# Altium schematic sheet OPA2350.SchDoc
size A4
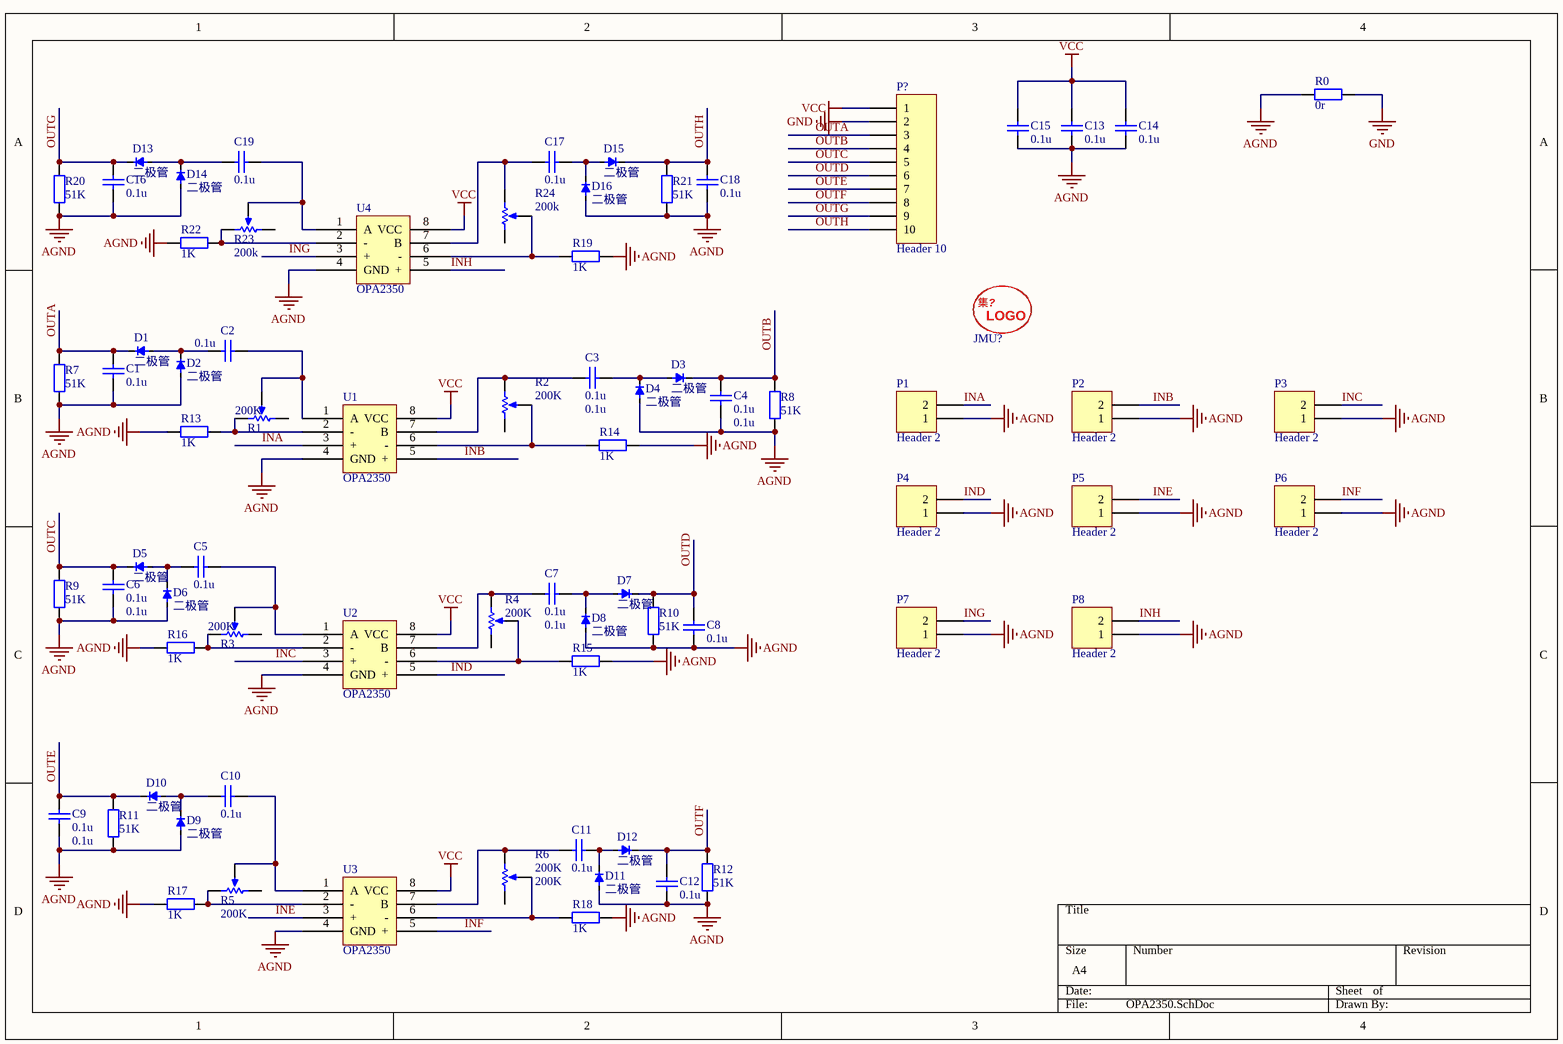
[diagram p0: OPA2350.SchDoc]

## Parts
C1  0.1u  [0805]
C2  0.1u  [0805]
C3  0.1u  [0805]
C4  0.1u  [0805]
C5  0.1u  [0805]
C6  0.1u  [0805]
C7  0.1u  [0805]
C8  0.1u  [0805]
C9  0.1u  [0805]
C10  0.1u  [0805]
C11  0.1u  [0805]
C12  0.1u  [0805]
C13  0.1u  [0805]
C14  0.1u  [0805]
C15  0.1u  [0805]
C16  0.1u  [0805]
C17  0.1u  [0805]
C18  0.1u  [0805]
C19  0.1u  [0805]
D1  二极管  [二极管]
D2  二极管  [二极管]
D3  二极管  [二极管]
D4  二极管  [二极管]
D5  二极管  [二极管]
D6  二极管  [二极管]
D7  二极管  [二极管]
D8  二极管  [二极管]
D9  二极管  [二极管]
D10  二极管  [二极管]
D11  二极管  [二极管]
D12  二极管  [二极管]
D13  二极管  [二极管]
D14  二极管  [二极管]
D15  二极管  [二极管]
D16  二极管  [二极管]
JMU?  LOGO(JMU)  [JMU_logo（1）]  (value not drawn)
P1  Header 2  [HDR1X2]
P2  Header 2  [HDR1X2]
P3  Header 2  [HDR1X2]
P4  Header 2  [HDR1X2]
P5  Header 2  [HDR1X2]
P6  Header 2  [HDR1X2]
P7  Header 2  [HDR1X2]
P8  Header 2  [HDR1X2]
P?  Header 10  [HDR1X10]
R0  0r  [0805]
R1  200K  [VR5]
R2  200K  [VR5]
R3  200K  [VR5]
R4  200K  [VR5]
R5  200K  [VR5]
R6  200K  [VR5]
R7  51K  [0805]
R8  51K  [0805]
R9  51K  [0805]
R10  51K  [0805]
R11  51K  [0805]
R12  51K  [0805]
R13  1K  [0805]
R14  1K  [0805]
R15  1K  [0805]
R16  1K  [0805]
R17  1K  [0805]
R18  1K  [0805]
R19  1K  [0805]
R20  51K  [0805]
R21  51K  [0805]
R22  1K  [0805]
R23  200k  [VR5]
R24  200k  [VR5]
U1  OPA2350  [SOIC-8]
U2  OPA2350  [SOIC-8]
U3  OPA2350  [SOIC-8]
U4  OPA2350  [SOIC-8]

## Nets
AGND: C1.1 C4.1 C6.1 C8.1 C9.1 C12.1 C13.1 C14.1 C15.1 C16.1 C18.1 D2.1(+) D4.1(+) D6.1(+) D8.1(+) D9.1(+) D11.1(+) D14.1(+) D16.1(+) P1.1 P2.1 P3.1 P4.1 P5.1 P6.1 P7.1 P8.1 R0.1 R7.1 R8.1 R9.1 R10.1 R11.1 R12.1 R13.1 R14.2 R15.2 R16.1 R17.1 R18.2 R19.1 R20.2 R21.2 R22.1 U1.4(GND) U2.4(GND) U3.4(GND) U4.4(GND)
GND: P?.2 R0.2
VCC: C13.2 C14.2 C15.2 P?.1 U1.8(VCC) U2.8(VCC) U3.8(VCC) U4.8(VCC)
INA: P1.2 U1.3(+)
INB: P2.2 U1.5(+)
INC: P3.2 U2.3(+)
IND: P4.2 U2.5(+)
INE: P5.2 U3.3(+)
INF: P6.2 U3.5(+)
ING: P7.2 U4.3(+)
INH: P8.2 U4.5(+)
OUTA: C1.2 D1.2(-) P?.3 R7.2
OUTB: C4.2 D3.2(-) P?.4 R8.2
OUTC: C6.2 D5.2(-) P?.5 R9.2
OUTD: C8.2 D7.2(-) P?.6 R10.2
OUTE: C9.2 D10.2(-) P?.7 R11.2
OUTF: C12.2 D12.2(-) P?.8 R12.2
OUTG: C16.2 D13.2(-) P?.9 R20.1
OUTH: C18.2 D15.2(-) P?.10 R21.1
NetC2_1: C2.1 D1.1(+) D2.2(-)
NetC2_2: C2.2 R1.3(TAP) U1.1(A)
NetC3_1: C3.1 R2.2(BOT) U1.7(B)
NetC3_2: C3.2 D3.1(+) D4.2(-)
NetC5_1: C5.1 D5.1(+) D6.2(-)
NetC5_2: C5.2 R3.3(TAP) U2.1(A)
NetC7_1: C7.1 R4.2(BOT) U2.7(B)
NetC7_2: C7.2 D7.1(+) D8.2(-)
NetC10_1: C10.1 D9.2(-) D10.1(+)
NetC10_2: C10.2 R5.3(TAP) U3.1(A)
NetC11_1: C11.1 R6.2(BOT) U3.7(B)
NetC11_2: C11.2 D11.2(-) D12.1(+)
NetC17_1: C17.1 R24.2(BOT) U4.7(B)
NetC17_2: C17.2 D15.1(+) D16.2(-)
NetC19_1: C19.1 D13.1(+) D14.2(-)
NetC19_2: C19.2 R23.3(TAP) U4.1(A)
NetR1_2: R1.2(BOT) R13.2 U1.2(-)
NetR2_3: R2.3(TAP) R14.1 U1.6(-)
NetR3_2: R3.2(BOT) R16.2 U2.2(-)
NetR4_3: R4.3(TAP) R15.1 U2.6(-)
NetR5_2: R5.2(BOT) R17.2 U3.2(-)
NetR6_3: R6.3(TAP) R18.1 U3.6(-)
NetR19_2: R19.2 R24.3(TAP) U4.6(-)
NetR22_2: R22.2 R23.2(BOT) U4.2(-)

Not connected (* = marked no-connect by the designer): R1 1(TOP); R2 1(TOP); R3 1(TOP); R4 1(TOP); R5 1(TOP); R6 1(TOP); R23 1(TOP); R24 1(TOP)

## Notes on the sheet
- (in symbol JMU-LOGO) 集?; LOGO

## Library data of the parts
C1-C12 = Cap: 无极电容; Value: 0.1u
C13-C19 = Cap: 无极电容; Value: 10uF
JMU? = JMU-LOGO
P1-P8 = Header 2: Header, 2-Pin; LatestRevisionDate: 17-Jul-2002; LatestRevisionNote: Re-released for DXP Platform.; Publisher: Altium Limited
P? = Header 10: Header, 10-Pin; LatestRevisionDate: 17-Jul-2002; LatestRevisionNote: Re-released for DXP Platform.; Publisher: Altium Limited
R0 R7-R22 = Res: 通用电阻; Value: 10K
R1-R6 = RPot: Potentiometer; Sim Note: Enter the Resistance value and the set point into parameter fields.; Set Position: 0.5; Published: 8-Jun-2000; LatestRevisionDate: 17-Jul-2002; LatestRevisionNote: Re-released for DXP Platform.; PackageReference: VR5; Publisher: Altium Limited; PackageDescription: Variable Resistor, Thru-Hole; 3 Leads; Value: 200K
R23 R24 = RPot: Potentiometer; Sim Note: Enter the Resistance value and the set point into parameter fields.; Set Position: 0.5; Value: 1K; Published: 8-Jun-2000; LatestRevisionDate: 17-Jul-2002; LatestRevisionNote: Re-released for DXP Platform.; PackageReference: VR5; Publisher: Altium Limited; PackageDescription: Variable Resistor, Thru-Hole; 3 Leads
U1-U4 = OPA2350: 运放芯片